# EAGLE design rpi-to-pluto (EAGLE 6.6.0)
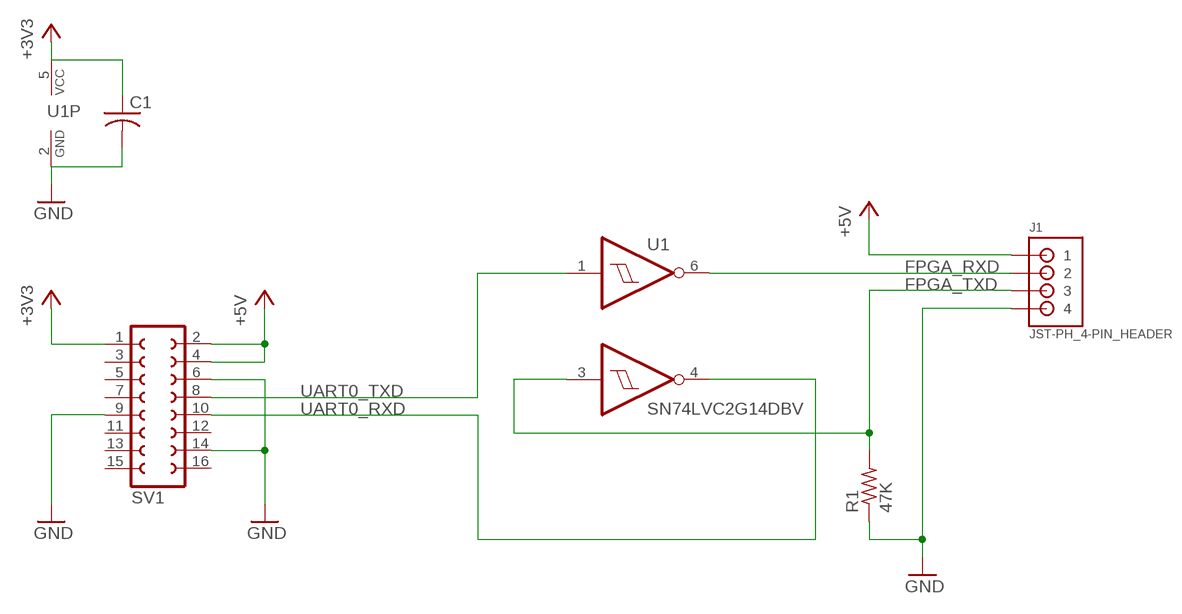
[diagram p0: schematic, sheet 1]

## Parts
C1  C-USC0805  [C0805]
J1  JST-PH_4-PIN_HEADER  [JST_B4B-PH_HEADER]
R1  47K  R-US_R0805  [R0805]
SV1  FE08-2  [FE08-2]
U1  SN74LVC2G14DBV  [SOT23-6]

## Nets
+3V3: C1.1 SV1.1 U1.5(VCC)
+5V: J1.P1 SV1.2 SV1.4
FPGA_RXD: J1.P2 U1.6(1Y)
FPGA_TXD: J1.P3 R1.2 U1.3(2A)
GND: C1.2 J1.P4 R1.1 SV1.6 SV1.9 SV1.14 U1.2(GND)
UART0_RXD: SV1.10 U1.4(2Y)
UART0_TXD: SV1.8 U1.1(1A)
Unconnected: SV1.3 SV1.5 SV1.7 SV1.11 SV1.12 SV1.13 SV1.15 SV1.16

## Library data of the parts
C1 = resistor:C-US: CAPACITOR, American symbol
J1 = SRG:JST-PH_4-PIN_HEADER: 4-pin JST PH Shrouded Header, top entry P/N B4B-PH-K-S Mating connector PHR-4 Mating cable assembly: Sparkfun PRT-09916 <http://www.sparkfun.com/products/9916>
R1 = resistor:R-US_: RESISTOR, American symbol
SV1 = con-lsta:FE08-2: FEMALE HEADER; OC_FARNELL: unknown; OC_NEWARK: unknown
U1 = lio:SN74*2G14: TinyLogic(R) UHS Inverter with Schmitt Trigger Input Source: http://www.ti.com/lit/ds/symlink/sn74lvc2g14.pdf

## Board
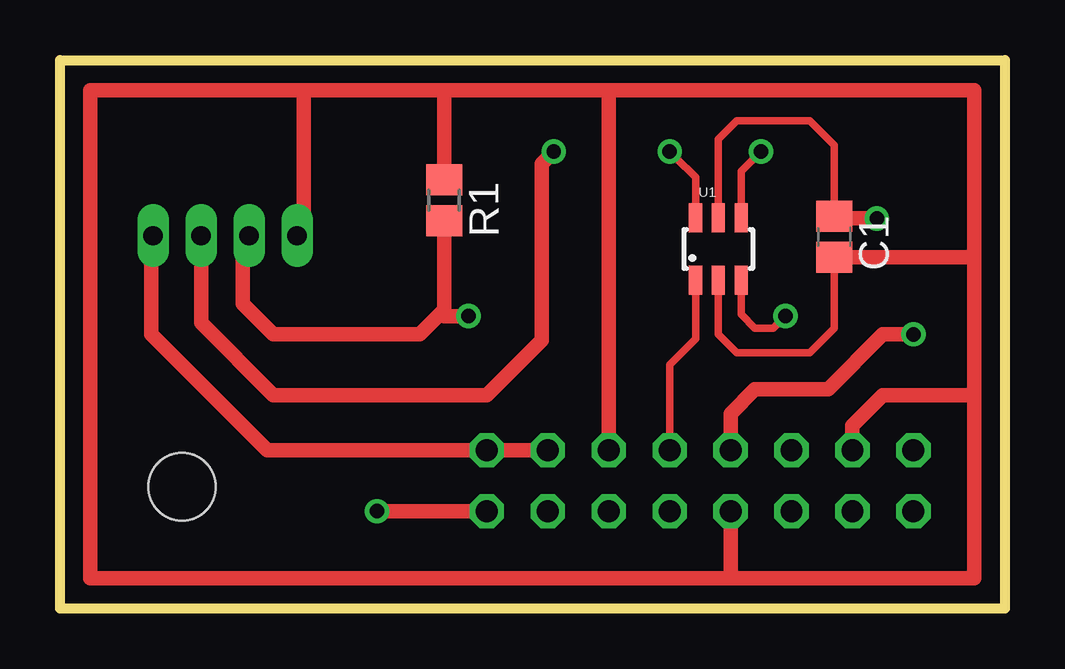
[diagram p1: board, top side]
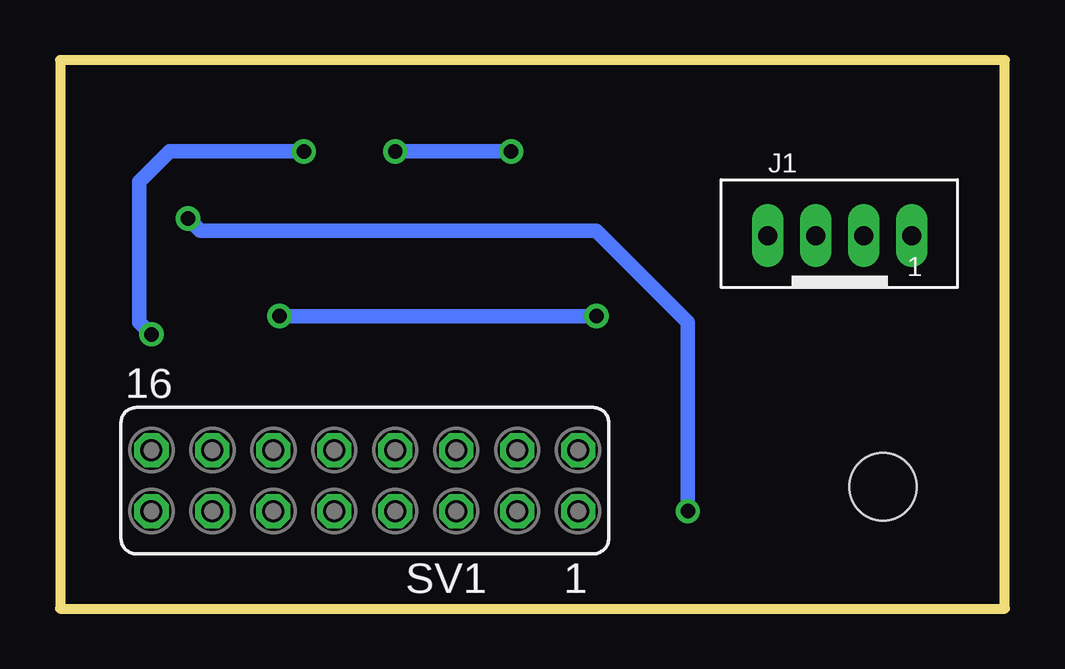
[diagram p2: board, bottom side, seen from below]

Size 39.37 x 22.86 mm. Coordinates in mm from the lower left corner, seen from the top.
Outline: 0,0 0,22.86 39.37,22.86 39.37,0 0,0
Copper layers (1*16): Top 0.035mm / dielectric 1.5mm / Bottom 0.035mm
Design rules "default": minimum track width 10mil, minimum drill 24mil, track to track 8mil, track to pad 8mil, pad to pad 8mil, via to via 8mil, smd to smd 8mil, copper to edge 40mil, drill to drill 8mil, minimum pad ring 10mil, minimum via ring 8mil, stop-mask expansion 4mil, vias tented up to drill 0mil, thermal gap 10mil
Holes 2.8 mm at 5.08,5.08

### Footprints (pad centres in the part's own frame; a part is rotated, then mirrored left to right if it is on the bottom)
C0805 = smd 1.3 x 1.5: 1 -0.85,0; 2 0.85,0
JST_B4B-PH_HEADER = drill 0.8 long: P1 2.98,0.048; P2 0.98,0.048; P3 -1.02,0.048; P4 -3.02,0.048
R0805 = smd 1.3 x 1.5: 1 -0.85,0; 2 0.85,0
FE08-2 = drill 0.914 octagon: 1 -8.89,1.27; 2 -8.89,-1.27; 3 -6.35,1.27; 4 -6.35,-1.27; 5 -3.81,1.27; 6 -3.81,-1.27; 7 -1.27,1.27; 8 -1.27,-1.27; 9 1.27,1.27; 10 1.27,-1.27; 11 3.81,1.27; 12 3.81,-1.27; 13 6.35,1.27; 14 6.35,-1.27; 15 8.89,1.27; 16 8.89,-1.27
SOT23-6 = smd 0.55 x 1.2: 1 -0.95,-1.3; 2 0,-1.3; 3 0.95,-1.3; 4 0.95,1.3; 5 0,1.3; 6 -0.95,1.3

### Placement (x,y rotation side)
C1  32.26,15.49 270 top
J1  6.86,15.49 0 bottom
R1  16,17.02 270 top
SV1  26.67,5.33 180 bottom
U1  27.43,14.99 0 top

### Tracks (layer width: path | path; a pad name or v marks a point on that pad's centre or on a via)
+3V3  (via drill 0.6)
  Top 0.305: U1.5 27.43,19.56 28.19,20.32 31.24,20.32 32.26,19.3 C1.1
  Top 0.61: SV1.1 v13.21,4.06 | v34.04,16.26 32.35,16.26 C1.1
  Bottom 0.61: v13.21,4.06 13.21,11.94 17.02,15.75 33.53,15.75 v34.04,16.26
+5V
  Top 0.61: SV1.4 SV1.2 8.64,6.6 3.81,11.43 3.81,15.47 J1.P1
FPGA_RXD  (via drill 0.6)
  Top 0.305: U1.6 26.48,17.97 25.65,18.8 v25.4,19.05
  Top 0.61: J1.P2 5.88,11.9 8.89,8.89 17.78,8.89 20.07,11.18 20.07,18.54 v20.57,19.05
  Bottom 0.61: v20.57,19.05 v25.4,19.05
FPGA_TXD  (via drill 0.6)
  Top 0.305: U1.3 28.38,12.26 28.96,11.68 29.72,11.68 v30.23,12.19 | 16,12.19 15.88,12.32
  Top 0.61: J1.P3 7.88,15.5 7.62,15.24 7.62,12.7 8.89,11.43 14.99,11.43 15.88,12.32 16,12.45 R1.2 | v17.02,12.19 16,12.19
  Bottom 0.61: v30.23,12.19 v17.02,12.19
GND
  Top 0.305: U1.2 27.43,11.43 28.19,10.67 31.24,10.67 32.26,11.68 C1.2
  Top 0.61: 27.94,1.27 1.27,1.27 1.27,21.59 10.16,21.59 | 10.16,21.59 10.16,15.82 J1.P4 | SV1.9 27.94,1.27 | 27.94,1.27 38.1,1.27 38.1,8.89 | 38.1,8.89 38.1,14.73 | 38.1,14.73 38.1,21.59 22.86,21.59 | 22.86,21.59 16,21.59 | 16,21.59 10.16,21.59 | SV1.6 22.86,21.59 | 38.1,8.89 34.29,8.89 33.02,7.62 SV1.14 | R1.1 16,21.59 | C1.2 38.01,14.64 38.1,14.73
UART0_RXD  (via drill 0.6)
  Top 0.305: U1.4 28.38,18.22 v29.21,19.05
  Top 0.61: v35.56,11.43 34.29,11.43 32,9.14 28.96,9.14 27.94,8.13 SV1.10
  Bottom 0.61: v29.21,19.05 34.8,19.05 36.07,17.78 36.07,11.94 v35.56,11.43
UART0_TXD
  Top 0.305: U1.1 26.48,11.24 25.4,10.16 SV1.8